# EAGLE design driverMotor (EAGLE 9.6.2)
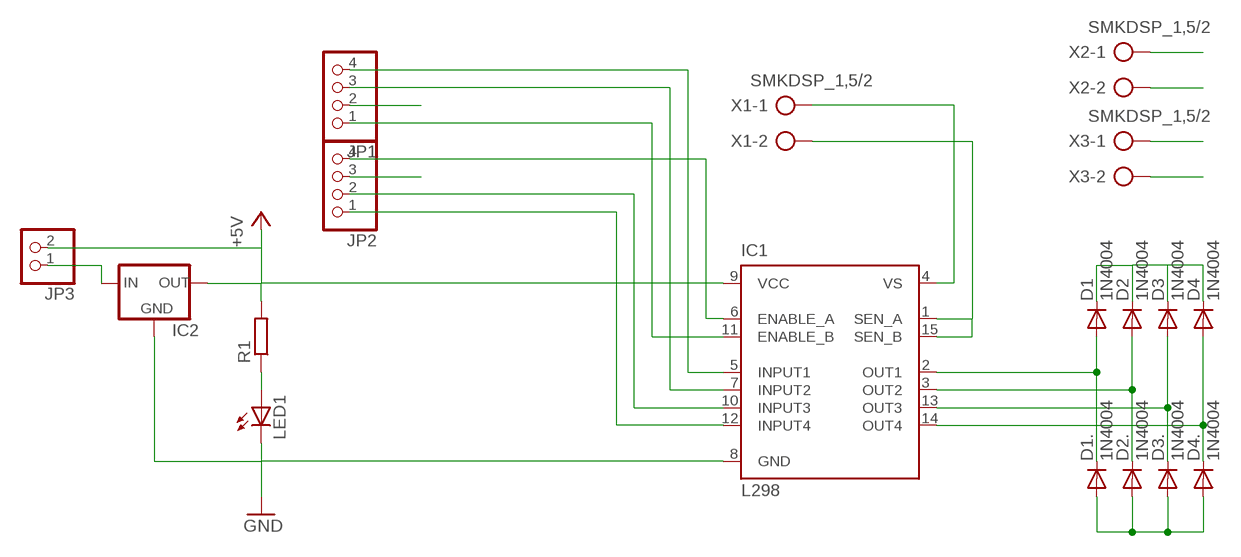
[diagram p0: schematic, sheet 1]

## Parts
D1  1N4004  [DO41-10]
D1.  1N4004  [DO41-10]
D2  1N4004  [DO41-10]
D2.  1N4004  [DO41-10]
D3  1N4004  [DO41-10]
D3.  1N4004  [DO41-10]
D4  1N4004  [DO41-10]
D4.  1N4004  [DO41-10]
IC1  L298  [MULTIWATT-15]
IC2  78MXXS  [78MXXS]
JP1  PINHD-1X4  [1X04]
JP2  PINHD-1X4  [1X04]
JP3  PINHD-1X2  [1X02]
LED1  LED5MM  [LED5MM]
R1  R-EU_0411/12  [0411/12]
X1  SMKDSP_1,5/2  [SMKDSP_1,5/2]
X2  SMKDSP_1,5/2  [SMKDSP_1,5/2]
X3  SMKDSP_1,5/2  [SMKDSP_1,5/2]

## Nets
+5V: IC1.9(VCC) IC2.OUT JP1.2 JP3.2 R1.2
ENABLE_A: IC1.6(ENABLE_A) JP2.4
ENABLE_B: IC1.11(ENABLE_B) JP1.1
GND: D1..A D2..A D3..A D4..A IC1.1(SEN_A) IC1.8(GND) IC1.15(SEN_B) IC2.GND JP2.3 LED1.K(C) X1.2
INPUT1: IC1.5(INPUT1) JP1.4
INPUT2: IC1.7(INPUT2) JP1.3
INPUT3: IC1.10(INPUT3) JP2.2
INPUT4: IC1.12(INPUT4) JP2.1
LED: LED1.A R1.1
MOTOR1_1: D1..C D1.A IC1.2(OUT1) X2.1
MOTOR1_2: D2..C D2.A IC1.3(OUT2) X2.2
MOTOR2_1: D3..C D3.A IC1.13(OUT3) X3.1
MOTOR2_2: D4..C D4.A IC1.14(OUT4) X3.2
N$1: IC2.IN JP3.1
VS: D1.C D2.C D3.C D4.C IC1.4(VS) X1.1

## Library data of the parts
D1 D1. D2 D2. D3 D3. D4 D4. = diode:1N4004: DIODE general purpose rectifier, 1 A
IC1 = st-microelectronics:L298: DUAL FULL-BRIDGE DRIVER
IC2 = v-reg:78MXXS: VOLTAGE REGULATOR
JP1 JP2 = pinhead:PINHD-1X4: PIN HEADER
JP3 = pinhead:PINHD-1X2: PIN HEADER
LED1 = led:LED: LED OSRAM: - CHIPLED LG R971, LG N971, LY N971, LG Q971, LY Q971, LO R971, LY R971 LH N974, LH R974 LS Q976, LO Q976, LY Q976 LO Q996 - Hyper CHIPLED LW Q18S LB Q993, LB Q99A, LB R99A - SideLED LS A670, LO A670, LY A670, LG A670, LP A670 LB A673, LV A673, LT A673, LW A673 LH A674 LY A675 LS A676, LA A676, LO A676, LY A676, LW A676 LS A679, LY A679, LG A679 - Hyper Micro SIDELED® LS Y876, LA Y876, LO Y876, LY Y876 LT Y87S - SmartLED LW L88C, LW L88S LB L89C, LB L89S, LG L890 LS L89K, LO L89K, LY L89K LS L896, LA L896, LO L896, LY L896 - TOPLED LS T670, LO T670, LY T670, LG T670, LP T670 LSG T670, LSP T670, LSY T670, LOP T670, LYG T670 LG T671, LOG T671, LSG T671 LB T673, LV T673, LT T673, LW T673 LH T674 LS T676, LA T676, LO T676, LY T676, LB T676, LH T676, LSB T676, LW T676 LB T67C, LV T67C, LT T67C, LS T67K, LO T67K, LY T67K, LW E67C LS E67B, LA E67B, LO E67B, LY E67B, LB E67C, LV E67C, LT E67C LW T67C LS T679, LY T679, LG T679 LS T770, LO T770, LY T770, LG T770, LP T770 LB T773, LV T773, LT T773, LW T773 LH T774 LS E675, LA E675, LY E675, LS T675 LS T776, LA T776, LO T776, LY T776, LB T776 LHGB T686 LT T68C, LB T68C - Hyper Mini TOPLED® LB M676 - Mini TOPLED Santana® LG M470 LS M47K, LO M47K, LY M47K Source: http://www.osram.convergy.de LUXEON: - LUMILED® LXK2-PW12-R00, LXK2-PW12-S00, LXK2-PW14-U00, LXK2-PW14-V00 LXK2-PM12-R00, LXK2-PM12-S00, LXK2-PM14-U00 LXK2-PE12-Q00, LXK2-PE12-R00, LXK2-PE12-S00, LXK2-PE14-T00, LXK2-PE14-U00 LXK2-PB12-K00, LXK2-PB12-L00, LXK2-PB12-M00, LXK2-PB14-N00, LXK2-PB14-P00, LXK2-PB14-Q00 LXK2-PR12-L00, LXK2-PR12-M00, LXK2-PR14-Q00, LXK2-PR14-R00 LXK2-PD12-Q00, LXK2-PD12-R00, LXK2-PD12-S00 LXK2-PH12-R00, LXK2-PH12-S00 LXK2-PL12-P00, LXK2-PL12-Q00, LXK2-PL12-R00 Source: www.luxeon.com KINGBRIGHT: KA-3528ASYC Source: www.kingbright.com
R1 = resistor:R-EU_: RESISTOR, European symbol
X1-X3 = con-phoenix-smkdsp:SMKDSP_1,5/2: Printklemme, Nennstrom: 17,5 A, Bemessungsspannung: 250 V, Raster: 5,0 mm Source: http://eshop.phoenixcontact.de .. 1733415.pdf; MF: FARNELL; MPN: 1733570; OC_FARNELL: 3041244; OC_NEWARK: 69C8588

## Board
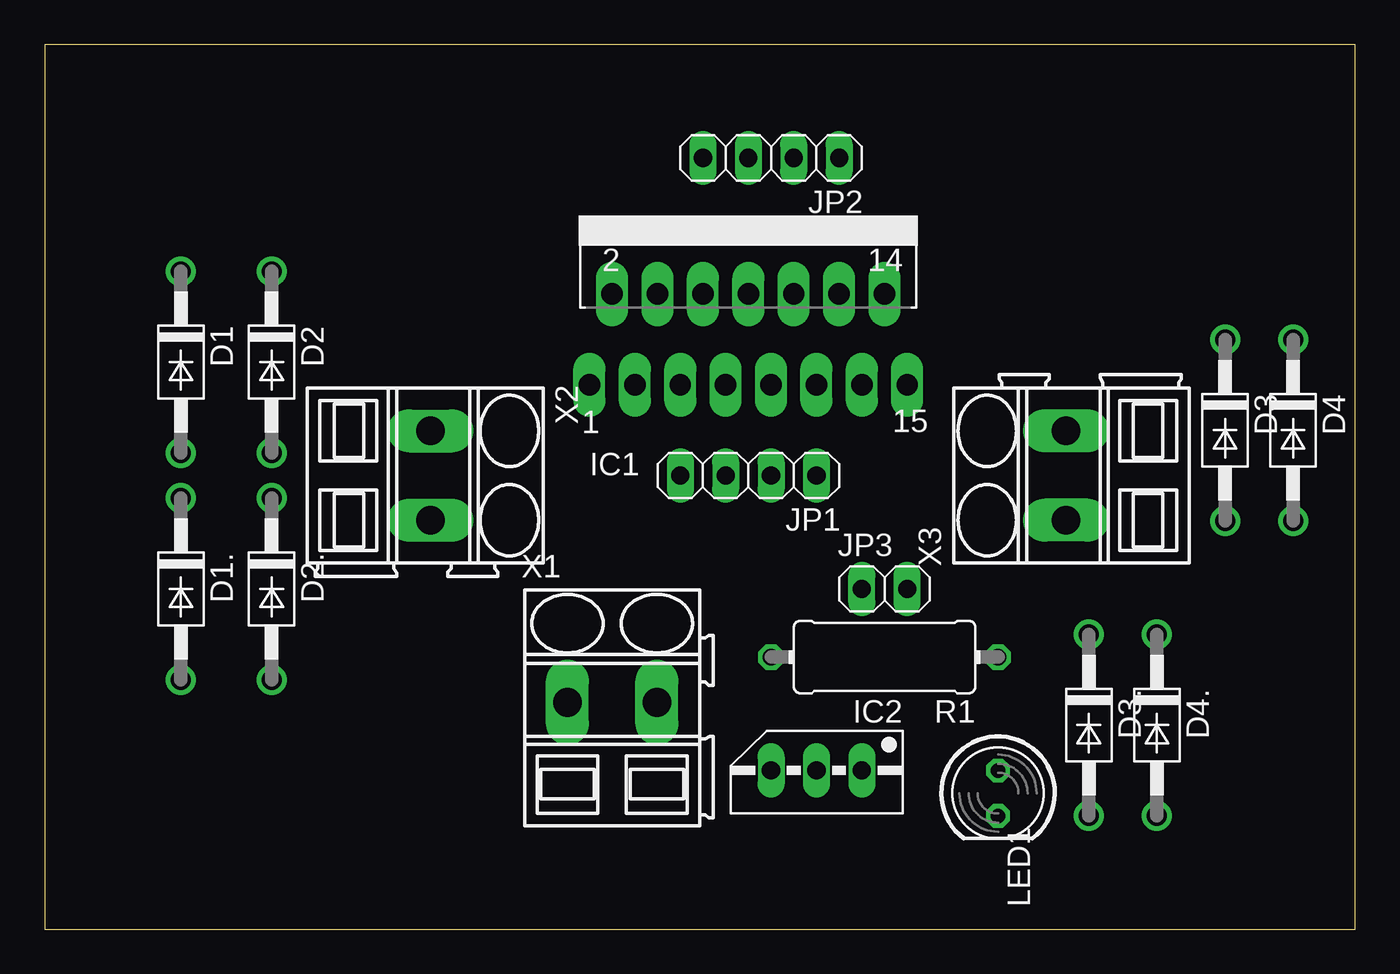
[diagram p1: board, top side]
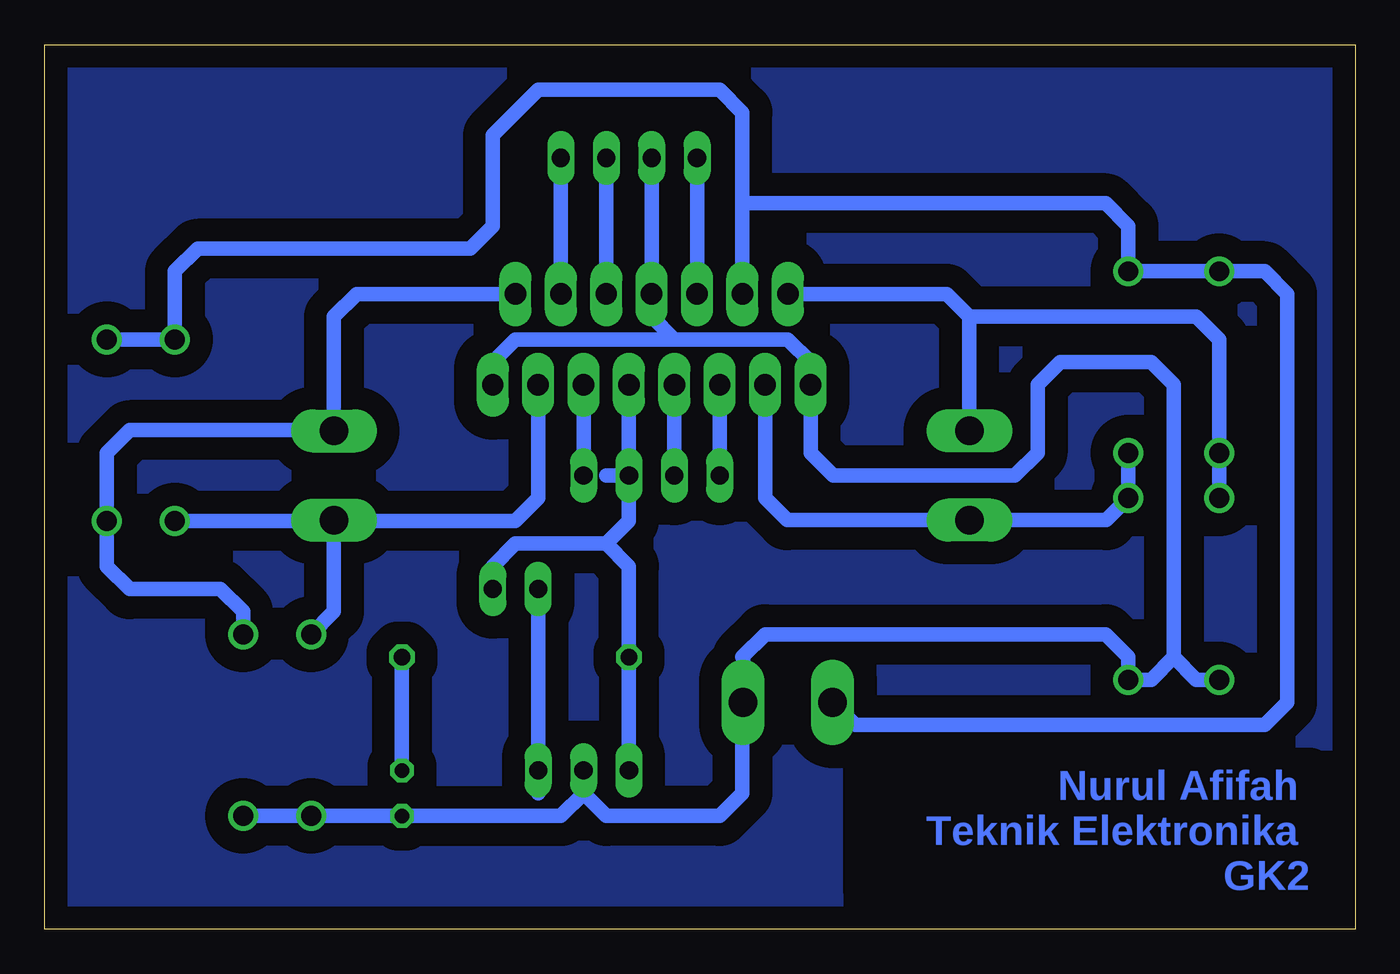
[diagram p2: board, bottom side, seen from below]

Size 73.33 x 49.52 mm. Coordinates in mm from the lower left corner, seen from the top.
Outline: 0,0 73.33,0 73.33,49.52 0,49.52 0,0
Copper layers (1*16): Top 0.035mm / dielectric 1.5mm / Bottom 0.035mm
Design rules "default": minimum track width 6mil, minimum drill 0.35mm, track to track 6mil, track to pad 6mil, pad to pad 6mil, via to via 6mil, smd to smd 6mil, copper to edge 40mil, drill to drill 6mil, minimum pad ring 10mil, minimum via ring 8mil, stop-mask expansion 4mil, vias tented up to drill 0mil, thermal gap 10mil

### Footprints (pad centres in the part's own frame; a part is rotated, then mirrored left to right if it is on the bottom)
DO41-10 = drill 1.118: A 5.08,0; C -5.08,0
MULTIWATT-15 = drill 1.2 long: 1 -8.89,-7.62; 2 -7.62,-2.54; 3 -6.35,-7.62; 4 -5.08,-2.54; 5 -3.81,-7.62; 6 -2.54,-2.54; 7 -1.27,-7.62; 8 0,-2.54; 9 1.27,-7.62; 10 2.54,-2.54; 11 3.81,-7.62; 12 5.08,-2.54; 13 6.35,-7.62; 14 7.62,-2.54; 15 8.89,-7.62
78MXXS = drill 1.016 long: GND 0,-2.54; IN -2.54,-2.54; OUT 2.54,-2.54
1X04 = drill 1.016 long: 1 -3.81,0; 2 -1.27,0; 3 1.27,0; 4 3.81,0
1X02 = drill 1.016 long: 1 -1.27,0; 2 1.27,0
LED5MM = drill 0.813 octagon: A -1.27,0; K 1.27,0
0411/12 = drill 0.914 octagon: 1 -6.35,0; 2 6.35,0
SMKDSP_1,5/2 = drill 1.6 pad 1.8 long: 1 -2.5,0; 2 2.5,0

### Placement (x,y rotation side)
D1  7.62,31.75 270 top
D1.  7.62,19.05 270 top
D2  12.7,31.75 270 top
D2.  12.7,19.05 270 top
D3  66.04,27.94 270 top
D3.  58.42,11.43 270 top
D4  69.85,27.94 270 top
D4.  62.23,11.43 270 top
IC1  39.37,38.1 0 top
IC2  43.18,6.35 180 top
JP1  39.37,25.4 180 top
JP2  40.64,43.18 180 top
JP3  46.99,19.05 0 top
LED1  53.34,7.62 270 top
R1  46.99,15.24 180 top
X1  31.75,12.7 0 top
X2  21.59,25.4 270 top
X3  57.15,25.4 90 top

### Tracks (layer width: path | path; a pad name or v marks a point on that pad's centre or on a via)
+5V
  Bottom 0.813: IC1.9 JP1.2 | JP1.2 41.91,25.4 | JP1.2 40.64,22.86 41.91,21.59 | 41.91,21.59 46.99,21.59 48.26,20.32 JP3.2 | 41.91,21.59 40.64,20.32 R1.2 IC2.OUT
ENABLE_A
  Bottom 0.813: JP2.4 IC1.6
ENABLE_B
  Bottom 0.813: IC1.11 JP1.1
GND
  Bottom 0.813: JP2.3 IC1.8 39.37,34.29 38.1,33.02 | 38.1,33.02 31.75,33.02 30.48,31.75 IC1.1 30.48,26.67 29.21,25.4 19.05,25.4 17.78,26.67 17.78,30.48 16.51,31.75 11.43,31.75 10.16,30.48 10.16,15.24 | 38.1,33.02 46.99,33.02 48.26,31.75 IC1.15 | 10.16,15.24 8.89,13.97 D1..A | 10.16,15.24 11.43,13.97 D2..A 12.7,15.24 13.97,16.51 33.02,16.51 34.29,15.24 34.25,15.2 X1.2 34.29,12.66 34.29,7.62 35.56,6.35 41.91,6.35 43.18,7.62 | IC2.GND 43.18,7.62 | 43.18,7.62 44.45,6.35 LED1.K D3..A D4..A
INPUT1
  Bottom 0.813: IC1.5 JP1.4
INPUT2
  Bottom 0.813: IC1.7 JP1.3
INPUT3
  Bottom 0.813: JP2.2 IC1.10
INPUT4
  Bottom 0.813: JP2.1 IC1.12
LED
  Bottom 0.813: R1.1 LED1.A
MOTOR1_1
  Bottom 0.813: 21.55,27.94 X2.1 21.59,34.29 | 21.59,34.29 22.86,35.56 IC1.2 | D1..C D1.A 7.62,33.02 8.89,34.29 21.59,34.29
MOTOR1_2
  Bottom 0.813: D2.A D2..C 13.93,22.9 X2.2 31.79,22.9 33.02,24.13 IC1.3
MOTOR2_1
  Bottom 0.813: X3.1 57.19,22.86 D3.A | IC1.13 45.72,24.13 46.99,22.86 57.11,22.86 X3.1 | X3.1 57.15,17.78 D3..C
MOTOR2_2
  Bottom 0.813: IC1.14 55.88,35.56 57.15,34.29 X3.2 57.19,27.94 68.58,27.94 69.85,26.67 D4.A 69.85,20.32 68.58,19.05 63.5,19.05 62.23,17.78 D4..C
N$1
  Bottom 0.813: JP3.1 IC2.IN 45.72,7.62
N$2
  pour Bottom (isolate 1.27): 0,49.53 73.66,49.53 73.66,1.27 73.66,0 0,0
VS
  Bottom 0.813: 34.29,36.83 IC1.4 34.29,40.64 | D4.C D3.C 66.04,36.83 64.77,38.1 49.53,38.1 48.26,39.37 48.26,44.45 45.72,46.99 35.56,46.99 34.29,45.72 34.29,40.64 | 34.29,40.64 13.97,40.64 12.7,39.37 D2.C D1.C 5.08,36.83 3.81,35.56 3.81,12.7 5.08,11.43 27.98,11.43 X1.1

### Text on the board
Bottom: Nurul Afifah / Teknik Elektronika / GK2